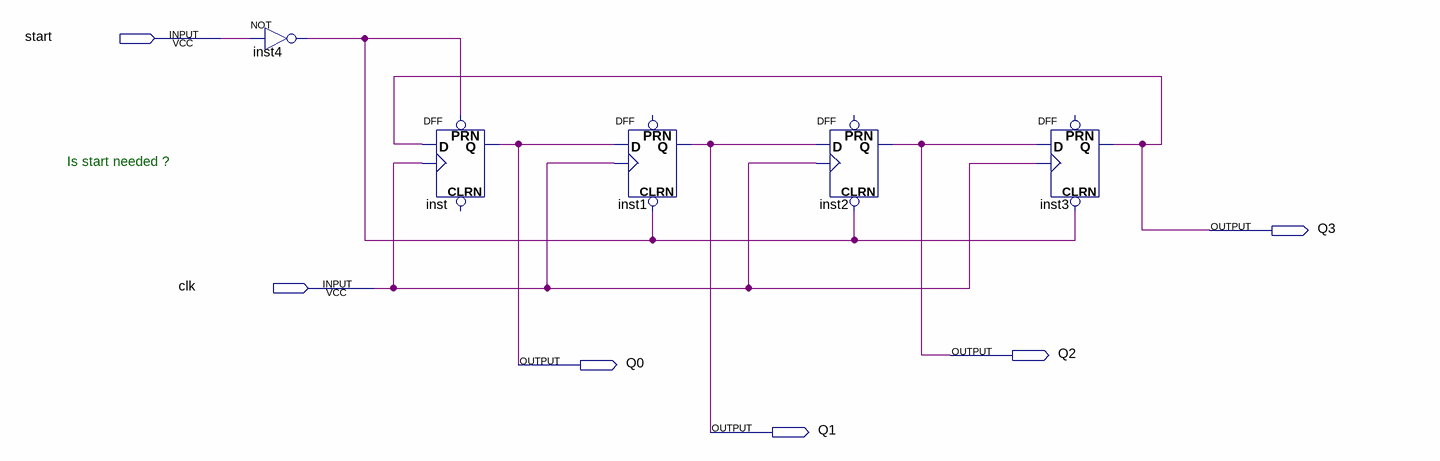
[diagram p0: schematic sheet]
// Quartus schematic ring_counter4.bdf as structural Verilog: 5 symbols, 6 pins
module ring_counter4 (
  input  start,
  input  clk,
  output Q3,
  output Q2,
  output Q0,
  output Q1
);

  wire inst4_out;

  not inst4 (inst4_out, start);
  DFF inst (.CLK(clk), .D(Q3), .PRN(inst4_out), .Q(Q0));  // open: CLRN
  DFF inst1 (.CLRN(inst4_out), .CLK(clk), .D(Q0), .Q(Q1));  // open: PRN
  DFF inst2 (.CLRN(inst4_out), .CLK(clk), .D(Q1), .Q(Q2));  // open: PRN
  DFF inst3 (.CLRN(inst4_out), .CLK(clk), .D(Q2), .Q(Q3));  // open: PRN

  // Notes on the sheet:
  //   Is start needed ?
endmodule
